# EAGLE design Clock2Smaller (EAGLE 6.5.0)
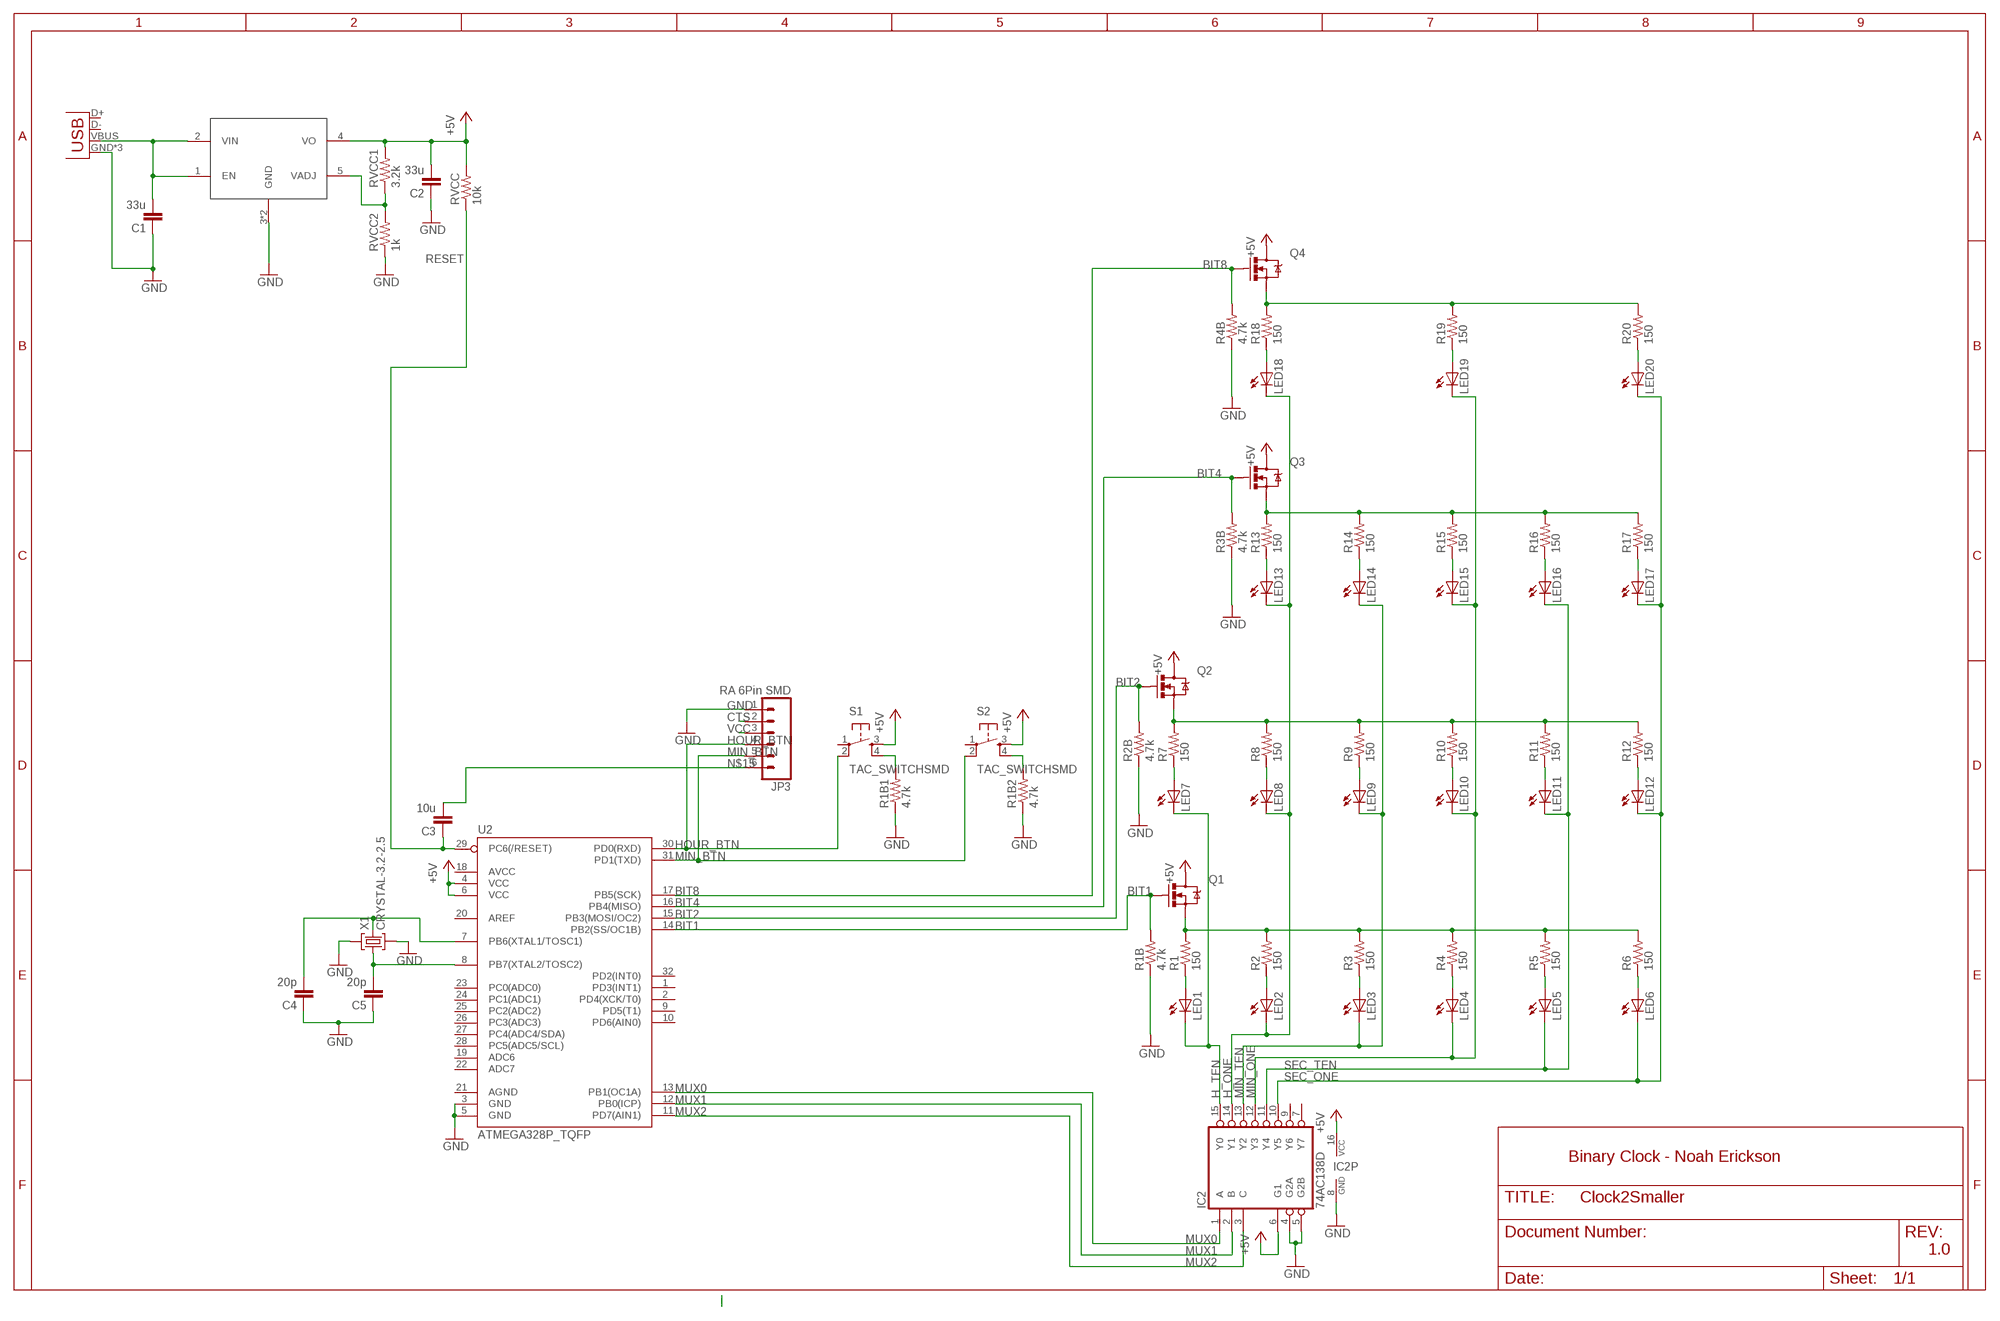
[diagram p0: schematic, sheet 1]

## Parts
C1  33u  C-EUC0805  [C0805]
C2  33u  C-EUC0805  [C0805]
C3  10u  C-EUC0805  [C0805]
C4  20p  C-EUC0805  [C0805]
C5  20p  C-EUC0805  [C0805]
IC2  74AC138D  [SO16]
JP1  USB-MICROB  [USB-MICROB]
JP3  RA 6Pin SMD  M06SMD  [1X06-SMD]
LED1  LEDSML0805  [SML0805]
LED2  LEDSML0805  [SML0805]
LED3  LEDSML0805  [SML0805]
LED4  LEDSML0805  [SML0805]
LED5  LEDSML0805  [SML0805]
LED6  LEDSML0805  [SML0805]
LED7  LEDSML0805  [SML0805]
LED8  LEDSML0805  [SML0805]
LED9  LEDSML0805  [SML0805]
LED10  LEDSML0805  [SML0805]
LED11  LEDSML0805  [SML0805]
LED12  LEDSML0805  [SML0805]
LED13  LEDSML0805  [SML0805]
LED14  LEDSML0805  [SML0805]
LED15  LEDSML0805  [SML0805]
LED16  LEDSML0805  [SML0805]
LED17  LEDSML0805  [SML0805]
LED18  LEDSML0805  [SML0805]
LED19  LEDSML0805  [SML0805]
LED20  LEDSML0805  [SML0805]
Q1  MOSFET-NCHANNELBSS138  [SOT23-3]
Q2  MOSFET-NCHANNELBSS138  [SOT23-3]
Q3  MOSFET-NCHANNELBSS138  [SOT23-3]
Q4  MOSFET-NCHANNELBSS138  [SOT23-3]
R1  150  R-US_R0805  [R0805]
R1B  4.7k  R-US_R0805  [R0805]
R1B1  4.7k  R-US_R0805  [R0805]
R1B2  4.7k  R-US_R0805  [R0805]
R2  150  R-US_R0805  [R0805]
R2B  4.7k  R-US_R0805  [R0805]
R3  150  R-US_R0805  [R0805]
R3B  4.7k  R-US_R0805  [R0805]
R4  150  R-US_R0805  [R0805]
R4B  4.7k  R-US_R0805  [R0805]
R5  150  R-US_R0805  [R0805]
R6  150  R-US_R0805  [R0805]
R7  150  R-US_R0805  [R0805]
R8  150  R-US_R0805  [R0805]
R9  150  R-US_R0805  [R0805]
R10  150  R-US_R0805  [R0805]
R11  150  R-US_R0805  [R0805]
R12  150  R-US_R0805  [R0805]
R13  150  R-US_R0805  [R0805]
R14  150  R-US_R0805  [R0805]
R15  150  R-US_R0805  [R0805]
R16  150  R-US_R0805  [R0805]
R17  150  R-US_R0805  [R0805]
R18  150  R-US_R0805  [R0805]
R19  150  R-US_R0805  [R0805]
R20  150  R-US_R0805  [R0805]
RVCC  10k  R-US_R0805  [R0805]
RVCC1  3.2k  R-US_R0805  [R0805]
RVCC2  1k  R-US_R0805  [R0805]
S1  TAC_SWITCHSMD  [TACTILE-SWITCH-SMD]
S2  TAC_SWITCHSMD  [TACTILE-SWITCH-SMD]
U2  ATMEGA328P_TQFP  [TQFP32-08]
U$1  TLF1963  [DPAK]
X1  CRYSTAL-3.2-2.5  [CRYSTAL-3.2-2.5]

## Nets
+5V: C2.2 IC2.6(G1) IC2.16(VCC) Q1.3(D) Q2.3(D) Q3.3(D) Q4.3(D) RVCC1.2 RVCC.2 S1.3 S2.3 U2.4(VCC) U2.6(VCC) U$1.4(VO)
BIT1: Q1.1(G) R1B.2 U2.14(PB2(SS/OC1B))
BIT2: Q2.1(G) R2B.2 U2.15(PB3(MOSI/OC2))
BIT4: Q3.1(G) R3B.2 U2.16(PB4(MISO))
BIT8: Q4.1(G) R4B.2 U2.17(PB5(SCK))
CTS: JP3.2
GND: C1.1 C2.1 C4.1 C5.1 IC2.4(G2A) IC2.5(G2B) IC2.8(GND) JP1.GND JP1.MT1(GND) JP1.MT2(GND) JP3.1 R1B1.1 R1B2.1 R1B.1 R2B.1 R3B.1 R4B.1 RVCC2.1 U2.3(GND) U2.5(GND) U$1.3(GND) U$1.6(GND) X1.2(GND) X1.4(GND)
H_ONE: IC2.14(Y1) LED2.C LED8.C LED13.C LED18.C
H_TEN: IC2.15(Y0) LED1.C LED7.C
HOUR_BTN: JP3.4 S1.2 U2.30(PD0(RXD))
MIN_BTN: JP3.5 S2.2 U2.31(PD1(TXD))
MIN_ONE: IC2.12(Y3) LED4.C LED10.C LED15.C LED19.C
MIN_TEN: IC2.13(Y2) LED3.C LED9.C LED14.C
MUX0: IC2.1(A) U2.13(PB1(OC1A))
MUX1: IC2.2(B) U2.12(PB0(ICP))
MUX2: IC2.3(C) U2.11(PD7(AIN1))
N$1: C1.2 JP1.VBUS U$1.1(EN) U$1.2(VIN)
N$2: C5.2 U2.8(PB7(XTAL2/TOSC2)) X1.1(C1)
N$4: C4.2 U2.7(PB6(XTAL1/TOSC1)) X1.3(C2)
N$7: Q4.2(S) R18.2 R19.2 R20.2
N$9: LED1.A R1.1
N$10: Q1.2(S) R1.2 R2.2 R3.2 R4.2 R5.2 R6.2
N$11: R1B1.2 S1.4
N$12: R1B2.2 S2.4
N$13: LED2.A R2.1
N$14: RVCC1.1 RVCC2.2 U$1.5(VADJ)
N$15: C3.2 JP3.6
N$17: LED3.A R3.1
N$21: LED7.A R7.1
N$22: Q2.2(S) R7.2 R8.2 R9.2 R10.2 R11.2 R12.2
N$25: LED8.A R8.1
N$28: LED13.A R13.1
N$29: LED9.A R9.1
N$32: Q3.2(S) R13.2 R14.2 R15.2 R16.2 R17.2
N$34: LED4.A R4.1
N$38: LED5.A R5.1
N$40: LED18.A R18.1
N$42: LED6.A R6.1
N$46: LED10.A R10.1
N$50: LED11.A R11.1
N$54: LED12.A R12.1
N$60: LED14.A R14.1
N$64: LED15.A R15.1
N$68: LED19.A R19.1
N$72: LED16.A R16.1
N$76: LED17.A R17.1
N$80: LED20.A R20.1
RESET: C3.1 RVCC.1 U2.29(PC6(/RESET))
SEC_ONE: IC2.10(Y5) LED6.C LED12.C LED17.C LED20.C
SEC_TEN: IC2.11(Y4) LED5.C LED11.C LED16.C
VCC: JP3.3
Unconnected: IC2.7(Y7) IC2.9(Y6) JP1.D+ JP1.D- S1.1 S2.1 U2.1(PD3(INT1)) U2.2(PD4(XCK/T0)) U2.9(PD5(T1)) U2.10(PD6(AIN0)) U2.18(AVCC) U2.19(ADC6) U2.20(AREF) U2.21(AGND) U2.22(ADC7) U2.23(PC0(ADC0)) U2.24(PC1(ADC1)) U2.25(PC2(ADC2)) U2.26(PC3(ADC3)) U2.27(PC4(ADC4/SDA)) U2.28(PC5(ADC5/SCL)) U2.32(PD2(INT0))

## Notes on the sheet
- Binary Clock - Noah Erickson
- 1.0

## Library data of the parts
C1-C5 = rcl:C-EU: CAPACITOR, European symbol
IC2 = 74xx-eu:74*138: 3-line to 8-line DECODER/DEMULTIPLEXER
JP1 = SparkFun-Connectors:USB: USB Connectors USB-B-PTH is fully proven SKU : PRT-00139/CONN-08278 USB-miniB is fully proven SKU : PRT-00587 USB-A-PCB is untested. USB-A-H is throughly reviewed, but untested. Spark Fun Electronics SKU : PRT-00437 USB-B-SMT is throughly reviewed, but untested. Needs silkscreen touching up. USB-A-S has not been used/tested USB-MB-H has not been used/tested USB-MICROB has been used. CONN-09505; PROD_ID: CONN-09505
JP3 = SparkFun-Connectors:M06: Header 6 Standard 6-pin 0.1" header. Use with straight break away headers (SKU : PRT-00116), right angle break away headers (PRT-00553), swiss pins (PRT-00743), machine pins (PRT-00117), and female headers (PRT-00115). Molex polarized connector foot print use with SKU : PRT-08094 with associated crimp pins and housings. NOTES ON THE VARIANTS LOCK and LOCK_LONGPADS... This footprint was designed to help hold the alignment of a through-hole component (i.e. 6-pin header) while soldering it into place. You may notice that each hole has been shifted either up or down by 0.005 of an inch from it's more standard position (which is a perfectly straight line). This slight alteration caused the pins (the squares in the middle) to touch the edges of the holes. Because they are alternating, it causes a "brace" to hold the component in place. 0.005 has proven to be the perfect amount of "off-center" position when using our standard breakaway headers. Although looks a little odd when you look at the bare footprint, once you have a header in there, the alteration is very hard to notice. Also,if you push a header all the way into place, it is covered up entirely on the bottom side. This idea of altering the position of holes to aid alignment will be further integrated into the Sparkfun Library for other footprints. It can help hold any component with 3 or more connection pins.; PROD_ID: CONN-08971
LED1-LED20 = led:LED: LED OSRAM: - CHIPLED LG R971, LG N971, LY N971, LG Q971, LY Q971, LO R971, LY R971 LH N974, LH R974 LS Q976, LO Q976, LY Q976 LO Q996 - Hyper CHIPLED LW Q18S LB Q993, LB Q99A, LB R99A - SideLED LS A670, LO A670, LY A670, LG A670, LP A670 LB A673, LV A673, LT A673, LW A673 LH A674 LY A675 LS A676, LA A676, LO A676, LY A676, LW A676 LS A679, LY A679, LG A679 - Hyper Micro SIDELED® LS Y876, LA Y876, LO Y876, LY Y876 LT Y87S - SmartLED LW L88C, LW L88S LB L89C, LB L89S, LG L890 LS L89K, LO L89K, LY L89K LS L896, LA L896, LO L896, LY L896 - TOPLED LS T670, LO T670, LY T670, LG T670, LP T670 LSG T670, LSP T670, LSY T670, LOP T670, LYG T670 LG T671, LOG T671, LSG T671 LB T673, LV T673, LT T673, LW T673 LH T674 LS T676, LA T676, LO T676, LY T676, LB T676, LH T676, LSB T676, LW T676 LB T67C, LV T67C, LT T67C, LS T67K, LO T67K, LY T67K, LW E67C LS E67B, LA E67B, LO E67B, LY E67B, LB E67C, LV E67C, LT E67C LW T67C LS T679, LY T679, LG T679 LS T770, LO T770, LY T770, LG T770, LP T770 LB T773, LV T773, LT T773, LW T773 LH T774 LS E675, LA E675, LY E675, LS T675 LS T776, LA T776, LO T776, LY T776, LB T776 LHGB T686 LT T68C, LB T68C - Hyper Mini TOPLED® LB M676 - Mini TOPLED Santana® LG M470 LS M47K, LO M47K, LY M47K Source: http://www.osram.convergy.de LUXEON: - LUMILED® LXK2-PW12-R00, LXK2-PW12-S00, LXK2-PW14-U00, LXK2-PW14-V00 LXK2-PM12-R00, LXK2-PM12-S00, LXK2-PM14-U00 LXK2-PE12-Q00, LXK2-PE12-R00, LXK2-PE12-S00, LXK2-PE14-T00, LXK2-PE14-U00 LXK2-PB12-K00, LXK2-PB12-L00, LXK2-PB12-M00, LXK2-PB14-N00, LXK2-PB14-P00, LXK2-PB14-Q00 LXK2-PR12-L00, LXK2-PR12-M00, LXK2-PR14-Q00, LXK2-PR14-R00 LXK2-PD12-Q00, LXK2-PD12-R00, LXK2-PD12-S00 LXK2-PH12-R00, LXK2-PH12-S00 LXK2-PL12-P00, LXK2-PL12-Q00, LXK2-PL12-R00 Source: www.luxeon.com KINGBRIGHT: KA-3528ASYC Source: www.kingbright.com
Q1-Q4 = SparkFun-DiscreteSemi:MOSFET-NCHANNEL: Common NMOSFET Parts MFG P/N Store ID Prod ID FDD8780 TRANS-09984 SI7820DN TRANS-11055 FDS6630A IC-08089 2N7002PW TRANS-11151 FQP30N06L COM-10213 TRANS-10060 BSS123LT1G TRANS-08345 BSS138 TRANS-00830 BS170 2N7000; PROD_ID: TRANS-00830
R1 R1B R1B1 R1B2 R2 R2B R3 R3B R4 R4B R5-R20 RVCC RVCC1 RVCC2 = rcl:R-US_: RESISTOR, American symbol
S1 S2 = SparkFun-Electromechanical:TAC_SWITCH: Momentary Switch Button commonly used for reset or general input. Spark Fun Electronics SKU : COM-00097 SMT- SWCH-08247; PROD_ID: SWCH-08247
U2 = SparkFun-DigitalIC:ATMEGA328P_TQFP; PROD_ID: IC-09069
U$1 = Dash parts:TLF1963
X1 = SmartPrj:CRYSTAL-3.2-2.5

## Board
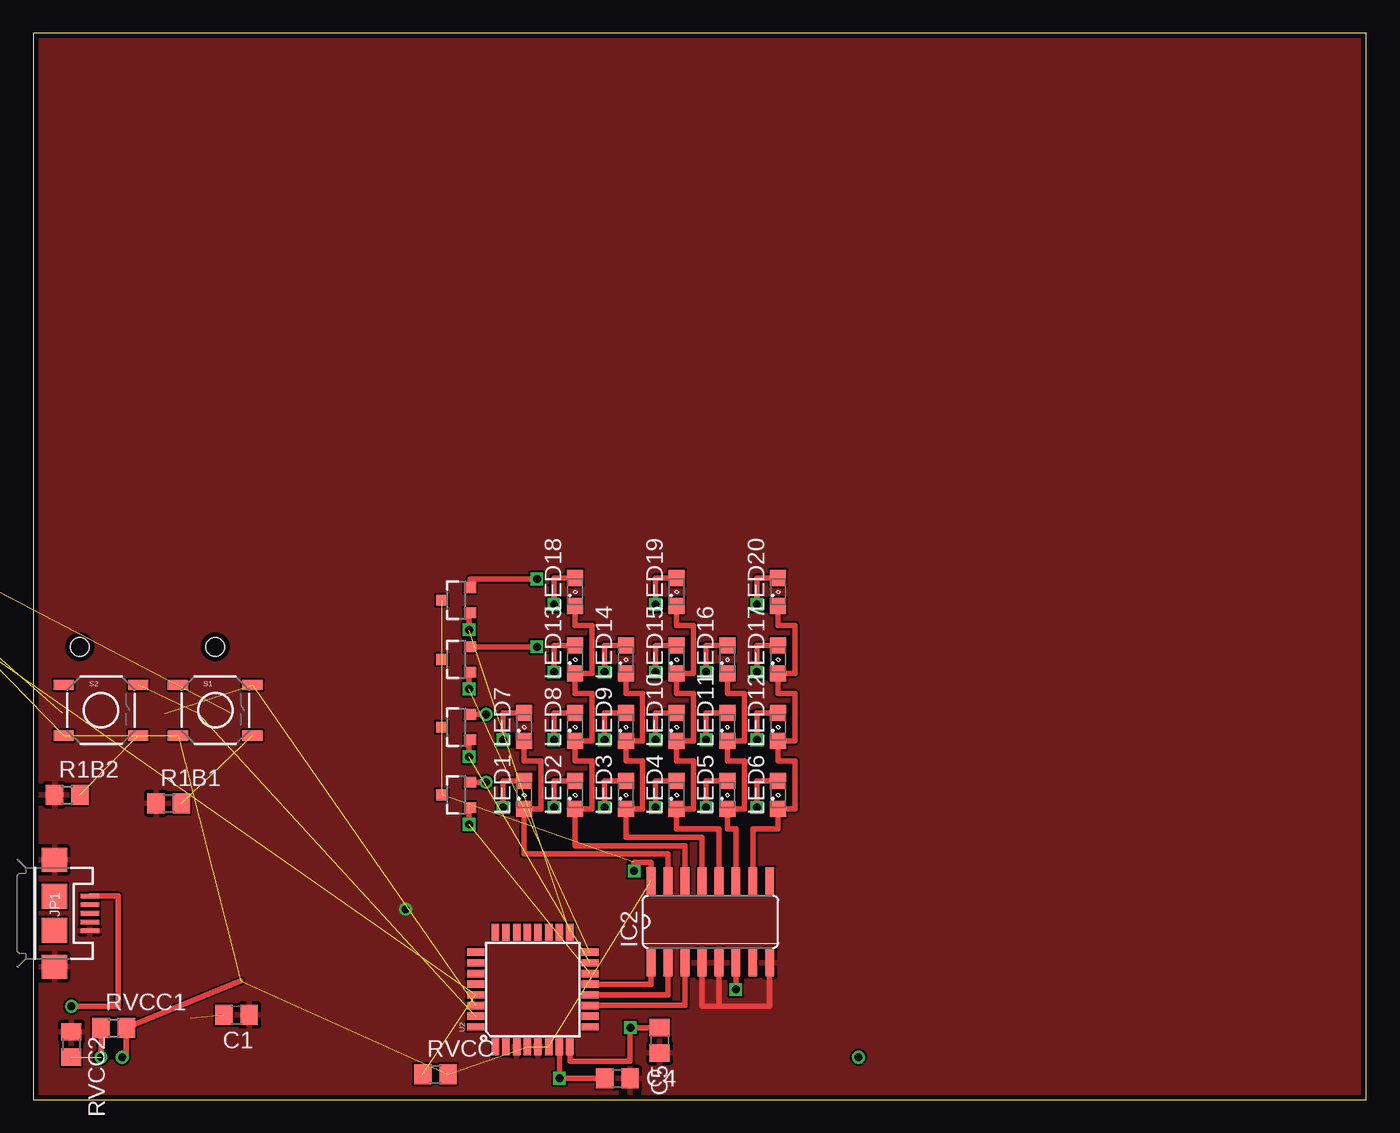
[diagram p1: board, top side]
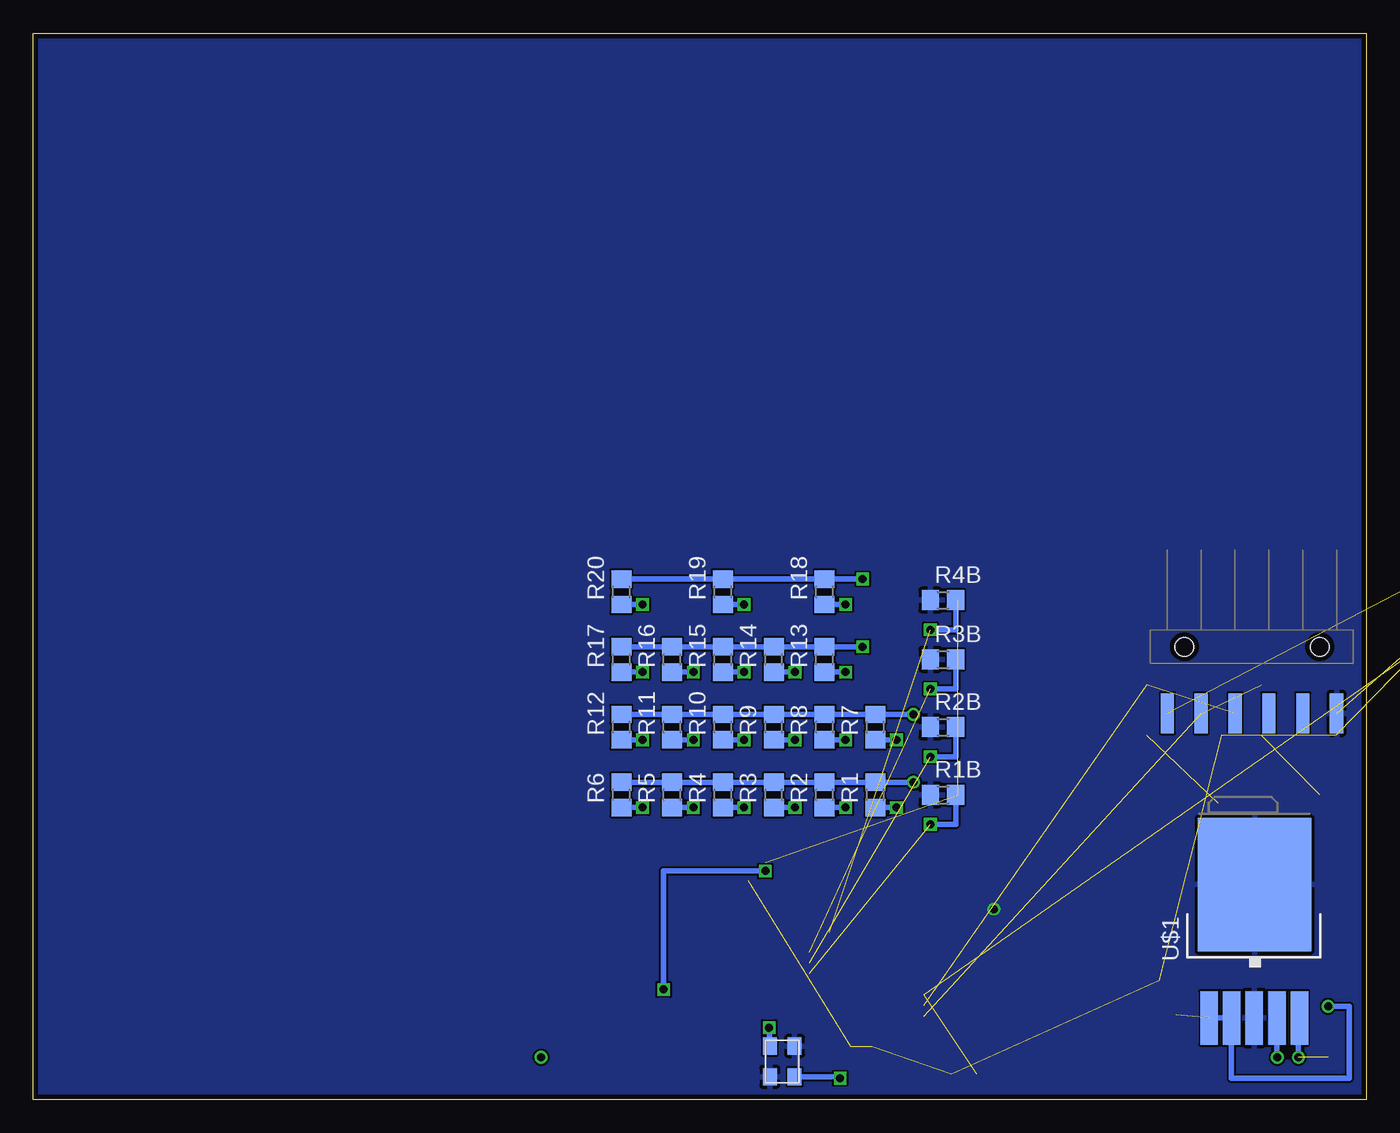
[diagram p2: board, bottom side, seen from below]

Size 100 x 80 mm. Coordinates in mm from the lower left corner, seen from the top.
Outline: 0,0 100,0 100,80 0,80 0,0
Copper layers (1*16): Top 0.0356mm / dielectric 1.5011mm / Bottom 0.0356mm
Design rules "LaenPCBOrder": minimum track width 6mil, minimum drill 13mil, track to track 6mil, track to pad 6mil, pad to pad 6mil, via to via 6mil, smd to smd 6mil, copper to edge 15mil, drill to drill 6mil, minimum pad ring 7mil, minimum via ring 7mil, stop-mask expansion 3mil, vias tented up to drill 0mil, thermal gap 10mil

### Footprints (pad centres in the part's own frame; a part is rotated, then mirrored left to right if it is on the bottom)
C0805 = smd 1.3 x 1.5: 1 -0.95,0; 2 0.95,0
SO16 = smd 0.66 x 2.032: 1 -4.445,-3.073; 2 -3.175,-3.073; 3 -1.905,-3.073; 4 -0.635,-3.073; 5 0.635,-3.073; 6 1.905,-3.073; 7 3.175,-3.073; 8 4.445,-3.073; 9 4.445,3.073; 10 3.175,3.073; 11 1.905,3.073; 12 0.635,3.073; 13 -0.635,3.073; 14 -1.905,3.073; 15 -3.175,3.073; 16 -4.445,3.073
USB-MICROB = smd 0.35 x 1.4: D+ 0,2.65; D- -0.65,2.65; GND 1.3,2.65; ID 0.65,2.65; VBUS -1.3,2.65 | smd 1.8 x 1.9: MT1 -4,0; MT2 4,0 | smd 1.9 x 1.9: P$1 -1.27,0; P$2 1.27,0
1X06-SMD = smd 1 x 3: 1 -6.35,5; 2 -3.81,5; 3 -1.27,5; 4 1.27,5; 5 3.81,5; 6 6.35,5 | hole 1.4: -5.08,0; 5.08,0
SML0805 = smd 1.2 x 1.2: A 1.05,0; C -1.05,0
SOT23-3 = smd 0.8 x 0.9: 1 -0.95,-1; 2 0.95,-1; 3 0,1.1
R0805 = smd 1.3 x 1.5: 1 -0.95,0; 2 0.95,0
TACTILE-SWITCH-SMD = smd 1.524 x 0.762: 1 -2.794,1.905; 2 2.794,1.905; 3 -2.794,-1.905; 4 2.794,-1.905
TQFP32-08 = smd 1.27 x 0.559: 1 -4.293,2.8; 2 -4.293,2; 3 -4.293,1.2; 4 -4.293,0.4; 5 -4.293,-0.4; 6 -4.293,-1.2; 7 -4.293,-2; 8 -4.293,-2.8; 17 4.293,-2.8; 18 4.293,-2; 19 4.293,-1.2; 20 4.293,-0.4; 21 4.293,0.4; 22 4.293,1.2; 23 4.293,2; 24 4.293,2.8 | smd 0.559 x 1.27: 9 -2.8,-4.293; 10 -2,-4.293; 11 -1.2,-4.293; 12 -0.4,-4.293; 13 0.4,-4.293; 14 1.2,-4.293; 15 2,-4.293; 16 2.8,-4.293; 25 2.8,4.293; 26 2,4.293; 27 1.2,4.293; 28 0.4,4.293; 29 -0.4,4.293; 30 -1.2,4.293; 31 -2,4.293; 32 -2.8,4.293
DPAK = smd 1.31 x 4: 1 -2.28,-4.04; 2 -0.58,-4.04; 3 1.12,-4.04; 4 2.82,-4.04; 5 4.52,-4.04 | smd 8.5 x 10: 6 1.15,5.97
CRYSTAL-3.2-2.5 = smd 1.3 x 1.05: 1 -1.15,-0.925; 2 1.15,-0.925; 3 1.15,0.925; 4 -1.15,0.925

### Placement (x,y rotation side)
C1  15.24,6.35 180 top
C2  -20.32,49.53 0 top  (outside the outline)
C3  -25.4,49.53 0 top  (outside the outline)
C4  43.81,1.59 180 top
C5  46.99,4.45 90 top
IC2  50.8,13.34 0 top
JP1  1.59,13.97 270 top
JP3  8.57,33.97 180 bottom
LED1  36.83,22.86 90 top
LED2  40.64,22.86 90 top
LED3  44.45,22.86 90 top
LED4  48.26,22.86 90 top
LED5  52.07,22.86 90 top
LED6  55.88,22.86 90 top
LED7  36.83,27.94 90 top
LED8  40.64,27.94 90 top
LED9  44.45,27.94 90 top
LED10  48.26,27.94 90 top
LED11  52.07,27.94 90 top
LED12  55.88,27.94 90 top
LED13  40.64,33.02 90 top
LED14  44.45,33.02 90 top
LED15  48.26,33.02 90 top
LED16  52.07,33.02 90 top
LED17  55.88,33.02 90 top
LED18  40.64,38.1 90 top
LED19  48.26,38.1 90 top
LED20  55.88,38.1 90 top
Q1  31.75,22.86 90 top
Q2  31.75,27.94 90 top
Q3  31.75,33.02 90 top
Q4  31.75,37.47 90 top
R1  36.83,22.86 90 bottom
R1B  31.75,22.86 0 bottom
R1B1  10.16,22.23 0 top
R1B2  2.54,22.86 0 top
R2  40.64,22.86 90 bottom
R2B  31.75,27.94 0 bottom
R3  44.45,22.86 90 bottom
R3B  31.75,33.02 0 bottom
R4  48.26,22.86 90 bottom
R4B  31.75,37.47 0 bottom
R5  52.07,22.86 90 bottom
R6  55.88,22.86 90 bottom
R7  36.83,27.94 90 bottom
R8  40.64,27.94 90 bottom
R9  44.45,27.94 90 bottom
R10  48.26,27.94 90 bottom
R11  52.07,27.94 90 bottom
R12  55.88,27.94 90 bottom
R13  40.64,33.02 90 bottom
R14  44.45,33.02 90 bottom
R15  48.26,33.02 90 bottom
R16  52.07,33.02 90 bottom
R17  55.88,33.02 90 bottom
R18  40.64,38.1 90 bottom
R19  48.26,38.1 90 bottom
R20  55.88,38.1 90 bottom
RVCC  30.16,1.91 0 top
RVCC1  6.03,5.4 0 top
RVCC2  2.86,4.13 270 top
S1  13.65,29.21 0 top
S2  5.08,29.21 0 top
U2  37.47,8.26 90 top
U$1  9.53,10.16 0 bottom
X1  43.81,2.86 270 bottom

### Tracks (layer width: path | path; a pad name or v marks a point on that pad's centre or on a via)
+5V  (via drill 0.6)  (11 unrouted)
  Top 0.406: IC2.16 46.35,17.78 45.09,17.78 v45.09,17.14 | IC2.6 v52.7,8.26 | 15.56,8.89 RVCC1.2 6.98,3.17 v6.67,3.17
  Bottom 0.406: v52.7,8.26 52.7,17.14 v45.09,17.14 | U$1.4 6.71,3.17 v6.67,3.17
BIT1  (via drill 0.6)  (1 unrouted)
  Top 0.406: Q1.1 32.7,21.91 v32.7,20.64
  Bottom 0.406: v32.7,20.64 30.8,20.64 R1B.2
BIT2  (via drill 0.6)  (1 unrouted)
  Top 0.406: Q2.1 32.7,26.94 v32.7,25.72
  Bottom 0.406: v32.7,25.72 30.8,25.72 R2B.2
BIT4  (via drill 0.6)  (1 unrouted)
  Top 0.406: Q3.1 32.7,32.07 v32.7,30.8
  Bottom 0.406: v32.7,30.8 30.8,30.8 R3B.2
BIT8  (via drill 0.6)  (1 unrouted)
  Top 0.406: Q4.1 32.7,36.52 v32.7,35.24
  Bottom 0.406: v32.7,35.24 30.8,35.24 R4B.2
GND  (via drill 0.6)  (1 unrouted)
  Top 0.406: IC2.4 50.16,6.99 51.44,6.99 | IC2.5 51.44,6.99 | 51.44,6.99 55.24,6.99 IC2.8
  other vias: 27.94,14.29
  pour Bottom: 0,0 99.69,0 99.69,80.01 0,80.01
  pour Top: 0,0 100.33,0 100.33,80.01 0,80.01
H_ONE
  Top 0.406: LED18.C 40.64,35.56 41.91,35.56 41.91,31.97 LED13.C 40.64,30.48 41.91,30.48 41.91,26.89 LED8.C 40.64,25.4 41.91,25.4 41.91,21.81 LED2.C 40.64,19.05 48.9,19.05 IC2.14
H_TEN
  Top 0.406: IC2.15 47.62,18.41 36.83,18.41 LED1.C 38.1,21.81 38.1,25.4 36.83,25.4 LED7.C
HOUR_BTN  (2 unrouted)
MIN_BTN  (2 unrouted)
MIN_ONE
  Top 0.406: LED19.C 48.26,35.56 49.53,35.56 49.53,31.97 LED15.C 48.26,30.48 49.53,30.48 49.53,26.89 LED10.C 48.26,25.4 49.53,25.4 49.53,21.81 LED4.C 48.26,20.32 51.44,20.32 IC2.12
MIN_TEN
  Top 0.406: LED14.C 44.45,30.48 45.72,30.48 45.72,26.89 LED9.C 44.45,25.4 45.72,25.4 45.72,21.81 LED3.C 44.45,19.68 50.16,19.68 IC2.13
MUX0
  Top 0.406: IC2.1 46.35,8.65 U2.13
MUX1
  Top 0.406: IC2.2 47.62,7.86 U2.12
MUX2
  Top 0.406: IC2.3 48.9,7.05 U2.11
N$1  (via drill 0.6)  (1 unrouted)
  Top 0.406: v2.86,6.99 6.35,6.99 6.35,15.27 JP1.VBUS
  Bottom 0.406: U$1.1 U$1.2 10.11,1.59 1.27,1.59 1.27,6.99 v2.86,6.99
N$2  (via drill 0.6)
  Top 0.406: C5.2 v44.8,5.4 44.77,5.4 44.77,2.86 40.27,2.86 U2.8
  Bottom 0.406: X1.1 v44.8,5.4
N$3  (via drill 0.6)
  other vias: 61.91,3.17
N$4  (via drill 0.6)
  Top 0.406: C4.2 v39.47,1.59 U2.7
  Bottom 0.406: v39.47,1.59 39.47,1.71 X1.3
N$7  (via drill 0.6)
  Top 0.406: Q4.2 32.75,39.05 v37.78,39.05
  Bottom 0.406: R20.2 R19.2 R18.2 v37.78,39.05
N$9  (via drill 0.6)
  Top 0.406: v35.24,21.91 35.24,23.91 LED1.A
  Bottom 0.406: R1.1 v35.24,21.91
N$10  (via drill 0.6)
  Top 0.406: Q1.2 v33.97,23.81
  Bottom 0.406: R6.2 R5.2 R4.2 R3.2 R2.2 R1.2 v33.97,23.81
N$11  (1 unrouted)
N$12  (1 unrouted)
N$13  (via drill 0.6)
  Top 0.406: v39.05,21.91 39.05,23.91 LED2.A
  Bottom 0.406: R2.1 v39.05,21.91
N$14  (via drill 0.6)  (1 unrouted)
  Top 0.406: v5.08,3.17 RVCC1.1
  Bottom 0.406: v5.08,3.17 5.08,4.46 U$1.5
N$15  (1 unrouted)
N$17  (via drill 0.6)
  Top 0.406: v42.86,21.91 42.86,23.91 LED3.A
  Bottom 0.406: R3.1 v42.86,21.91
N$21  (via drill 0.6)
  Top 0.406: v35.24,26.99 35.24,28.99 LED7.A
  Bottom 0.406: R7.1 v35.24,26.99
N$22  (via drill 0.6)
  Top 0.406: Q2.2 v33.97,28.89
  Bottom 0.406: R12.2 R11.2 R10.2 R9.2 R8.2 R7.2 34.29,28.89 v33.97,28.89
N$25  (via drill 0.6)
  Top 0.406: v39.05,26.99 39.05,28.99 LED8.A
  Bottom 0.406: R8.1 v39.05,26.99
N$28  (via drill 0.6)
  Top 0.406: v39.05,32.07 39.05,34.07 LED13.A
  Bottom 0.406: R13.1 v39.05,32.07
N$29  (via drill 0.6)
  Top 0.406: v42.86,26.99 42.86,28.99 LED9.A
  Bottom 0.406: R9.1 v42.86,26.99
N$32  (via drill 0.6)
  Top 0.406: Q3.2 v37.78,33.97
  Bottom 0.406: R17.2 R16.2 R15.2 R14.2 R13.2 v37.78,33.97
N$34  (via drill 0.6)
  Top 0.406: v46.67,21.91 46.67,23.91 LED4.A
  Bottom 0.406: R4.1 v46.67,21.91
N$38  (via drill 0.6)
  Top 0.406: v50.48,21.91 50.48,23.91 LED5.A
  Bottom 0.406: R5.1 v50.48,21.91
N$40  (via drill 0.6)
  Top 0.406: v39.05,37.15 39.05,39.15 LED18.A
  Bottom 0.406: R18.1 v39.05,37.15
N$42  (via drill 0.6)
  Top 0.406: v54.29,21.91 54.29,23.91 LED6.A
  Bottom 0.406: R6.1 v54.29,21.91
N$46  (via drill 0.6)
  Top 0.406: v46.67,26.99 46.67,28.99 LED10.A
  Bottom 0.406: R10.1 v46.67,26.99
N$50  (via drill 0.6)
  Top 0.406: v50.48,26.99 50.48,28.99 LED11.A
  Bottom 0.406: R11.1 v50.48,26.99
N$54  (via drill 0.6)
  Top 0.406: v54.29,26.99 54.29,28.99 LED12.A
  Bottom 0.406: R12.1 v54.29,26.99
N$60  (via drill 0.6)
  Top 0.406: v42.86,32.07 42.86,34.07 LED14.A
  Bottom 0.406: R14.1 v42.86,32.07
N$64  (via drill 0.6)
  Top 0.406: v46.67,32.07 46.67,34.07 LED15.A
  Bottom 0.406: R15.1 v46.67,32.07
N$68  (via drill 0.6)
  Top 0.406: v46.67,37.15 46.67,39.15 LED19.A
  Bottom 0.406: R19.1 v46.67,37.15
N$72  (via drill 0.6)
  Top 0.406: v50.48,32.07 50.48,34.07 LED16.A
  Bottom 0.406: R16.1 v50.48,32.07
N$76  (via drill 0.6)
  Top 0.406: v54.29,32.07 54.29,34.07 LED17.A
  Bottom 0.406: R17.1 v54.29,32.07
N$80  (via drill 0.6)
  Top 0.406: v54.29,37.15 54.29,39.15 LED20.A
  Bottom 0.406: R20.1 v54.29,37.15
RESET  (2 unrouted)
SEC_ONE
  Top 0.406: LED20.C 55.88,35.56 57.15,35.56 57.15,31.97 LED17.C 55.88,30.48 57.15,30.48 57.15,26.89 LED12.C 55.88,25.4 57.15,25.4 57.15,21.81 LED6.C 55.88,20.32 53.98,20.32 IC2.10
SEC_TEN
  Top 0.406: LED16.C 52.07,30.48 53.34,30.48 53.34,26.89 LED11.C 52.07,25.4 53.34,25.4 53.34,21.81 LED5.C 52.07,20.32 52.7,20.32 IC2.11

### Text on the board
tCream: C5